# EAGLE design diff (EAGLE 7.7.0)
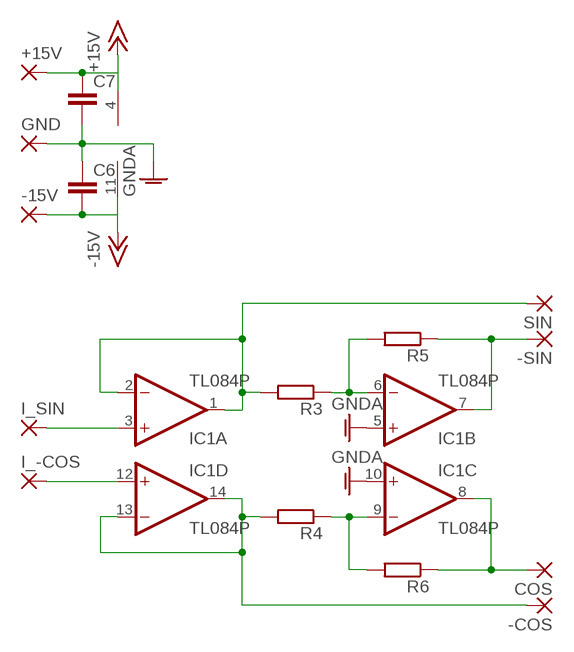
[diagram p0: schematic, sheet 1]

## Parts
+15V  2,15/1,0  [2,15/1,0]
-15V  2,15/1,0  [2,15/1,0]
-COS  2,15/1,0  [2,15/1,0]
-SIN  2,15/1,0  [2,15/1,0]
C6  C-EU050-030X075  [C050-030X075]
C7  C-EU050-030X075  [C050-030X075]
COS  2,15/1,0  [2,15/1,0]
GND  2,15/1,0  [2,15/1,0]
I_-COS  2,15/1,0  [2,15/1,0]
I_SIN  2,15/1,0  [2,15/1,0]
IC1  TL084P  [DIL14]
R3  R-EU_0309/V  [0309V]
R4  R-EU_0309/V  [0309V]
R5  R-EU_0309/V  [0309V]
R6  R-EU_0309/V  [0309V]
SIN  2,15/1,0  [2,15/1,0]

## Nets
+15V: +15V.1(P) C7.1 IC1.4(P:V+)
-15V: -15V.1(P) C6.2 IC1.11(P:V-)
GNDA: C6.1 C7.2 GND.1(P) IC1.5(B:+IN) IC1.10(C:+IN)
N$1: I_SIN.1(P) IC1.3(A:+IN)
N$2: I_-COS.1(P) IC1.12(D:+IN)
N$3: -COS.1(P) IC1.13(D:-IN) IC1.14(D:OUT) R4.2
N$4: IC1.1(A:OUT) IC1.2(A:-IN) R3.2 SIN.1(P)
N$5: IC1.6(B:-IN) R3.1 R5.2
N$6: -SIN.1(P) IC1.7(B:OUT) R5.1
N$7: IC1.9(C:-IN) R4.1 R6.2
N$8: COS.1(P) IC1.8(C:OUT) R6.1

## Library data of the parts
+15V -15V -COS -SIN COS GND I_-COS I_SIN SIN = wirepad:2,15/1,0: THROUGH-HOLE PAD
C6 C7 = rcl:C-EU: CAPACITOR, European symbol
IC1 = linear:TL084: OP AMP
R3-R6 = rcl:R-EU_: RESISTOR, European symbol

## Board
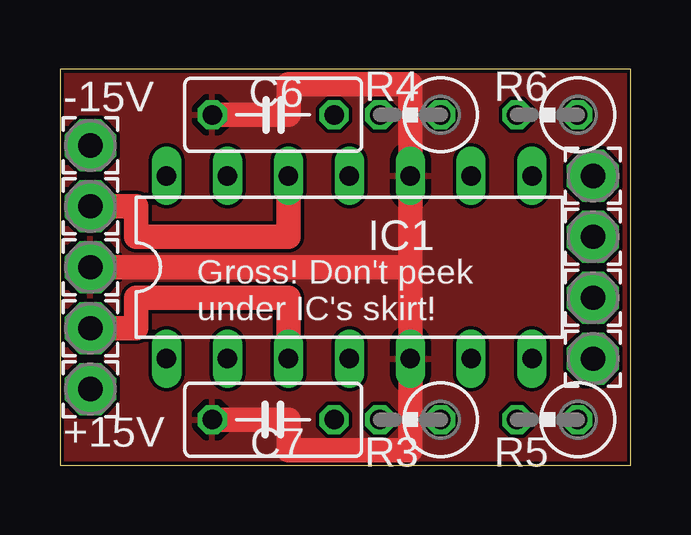
[diagram p1: board, top side]
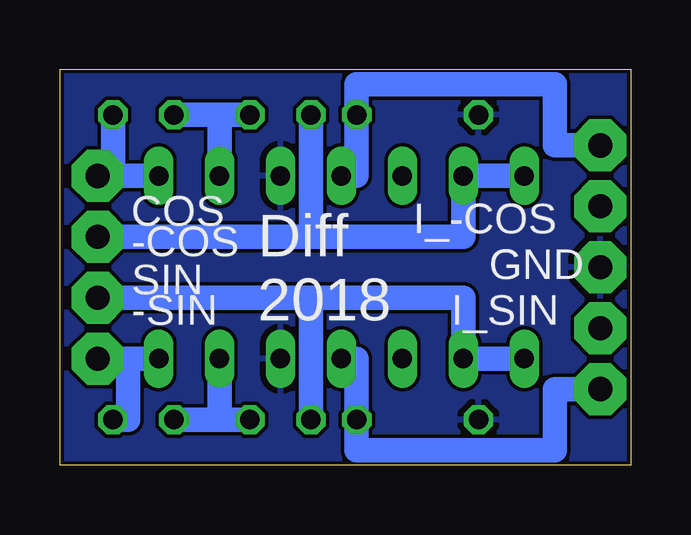
[diagram p2: board, bottom side, seen from below]

Size 23.8 x 16.5 mm. Coordinates in mm from the lower left corner, seen from the top.
Outline: 0,0 23.8,0 23.8,16.5 0,16.5 0,0
Copper layers (1*16): Top 0.035mm / dielectric 1.5mm / Bottom 0.035mm
Design rules "PCWway": minimum track width 6mil, minimum drill 0.3mm, track to track 6mil, track to pad 6mil, pad to pad 6mil, via to via 6mil, smd to smd 6mil, copper to edge 6mil, drill to drill 8mil, minimum pad ring 6mil, minimum via ring 6mil, stop-mask expansion 4mil, vias tented up to drill 0mil, thermal gap 10mil

### Footprints (pad centres in the part's own frame; a part is rotated, then mirrored left to right if it is on the bottom)
2,15/1,0 = drill 1.016 pad 2.159 octagon: 1 0,0
C050-030X075 = drill 0.813 octagon: 1 -2.54,0; 2 2.54,0
DIL14 = drill 0.813 long: 1 -7.62,-3.81; 2 -5.08,-3.81; 3 -2.54,-3.81; 4 0,-3.81; 5 2.54,-3.81; 6 5.08,-3.81; 7 7.62,-3.81; 8 7.62,3.81; 9 5.08,3.81; 10 2.54,3.81; 11 0,3.81; 12 -2.54,3.81; 13 -5.08,3.81; 14 -7.62,3.81
0309V = drill 0.813 octagon: 1 -1.27,0; 2 1.27,0

### Placement (x,y rotation side)
+15V  1.27,3.17 0 top
-15V  1.27,13.34 0 top
-COS  22.23,9.53 0 top
-SIN  22.23,4.45 0 top
C6  8.89,14.61 0 top
C7  8.89,1.91 180 top
COS  22.23,12.06 0 top
GND  1.27,8.26 0 top
I_-COS  1.27,10.79 0 top
I_SIN  1.27,5.71 0 top
IC1  12.06,8.26 0 top
R3  14.61,1.91 180 top
R4  14.61,14.61 180 top
R5  20.32,1.91 180 top
R6  20.32,14.61 180 top
SIN  22.23,6.99 0 top

### Tracks (layer width: path | path; a pad name or v marks a point on that pad's centre or on a via)
+15V
  Bottom 1.016: IC1.4 11.43,4.45 C7.1 11.43,0.64 3.17,0.64 3.17,3.17 +15V.1
-15V
  Bottom 1.016: IC1.11 11.43,12.06 C6.2 11.43,15.88 3.17,15.88 3.17,13.34 -15V.1
GNDA
  Top 1.016: GND.1 14.61,8.26 | 14.61,8.26 IC1.10 14.61,15.88 9.53,15.88 9.53,14.61 C6.1 | 14.61,8.26 IC1.5 14.61,0.64 9.53,0.64 9.53,1.91 C7.2
  pour Top: 0,16.51 23.81,16.51 23.81,0 0,0
  pour Bottom: 0,16.51 23.81,16.51 23.81,0 0,0
N$1
  Top 1.016: I_SIN.1 3.17,5.71 3.17,6.99 9.53,6.99 IC1.3
N$2
  Top 1.016: I_-COS.1 3.17,10.79 3.17,9.53 9.53,9.53 IC1.12
N$3
  Bottom 1.016: -COS.1 13.34,9.53 | 13.34,9.53 6.99,9.53 IC1.13 IC1.14 | R4.2 13.34,9.53
N$4
  Bottom 1.016: R3.2 13.34,6.99 | 13.34,6.99 6.99,6.99 IC1.2 IC1.1 | SIN.1 13.34,6.99
N$5
  Bottom 1.016: IC1.6 17.14,1.91 | 17.14,1.91 R3.1 | 17.14,1.91 R5.2
N$6
  Bottom 1.016: IC1.7 20.95,4.45 | 20.95,4.45 -SIN.1 | R5.1 20.95,1.91 20.95,4.45
N$7
  Bottom 1.016: IC1.9 17.14,14.61 | 17.14,14.61 R4.1 | 17.14,14.61 R6.2
N$8
  Bottom 1.016: IC1.8 COS.1 21.59,12.06 R6.1

### Text on the board
tNames: Gross! Don't peek / under IC's skirt!
bNames: Diff / 2018